# EAGLE design lcdork (EAGLE 5.06)
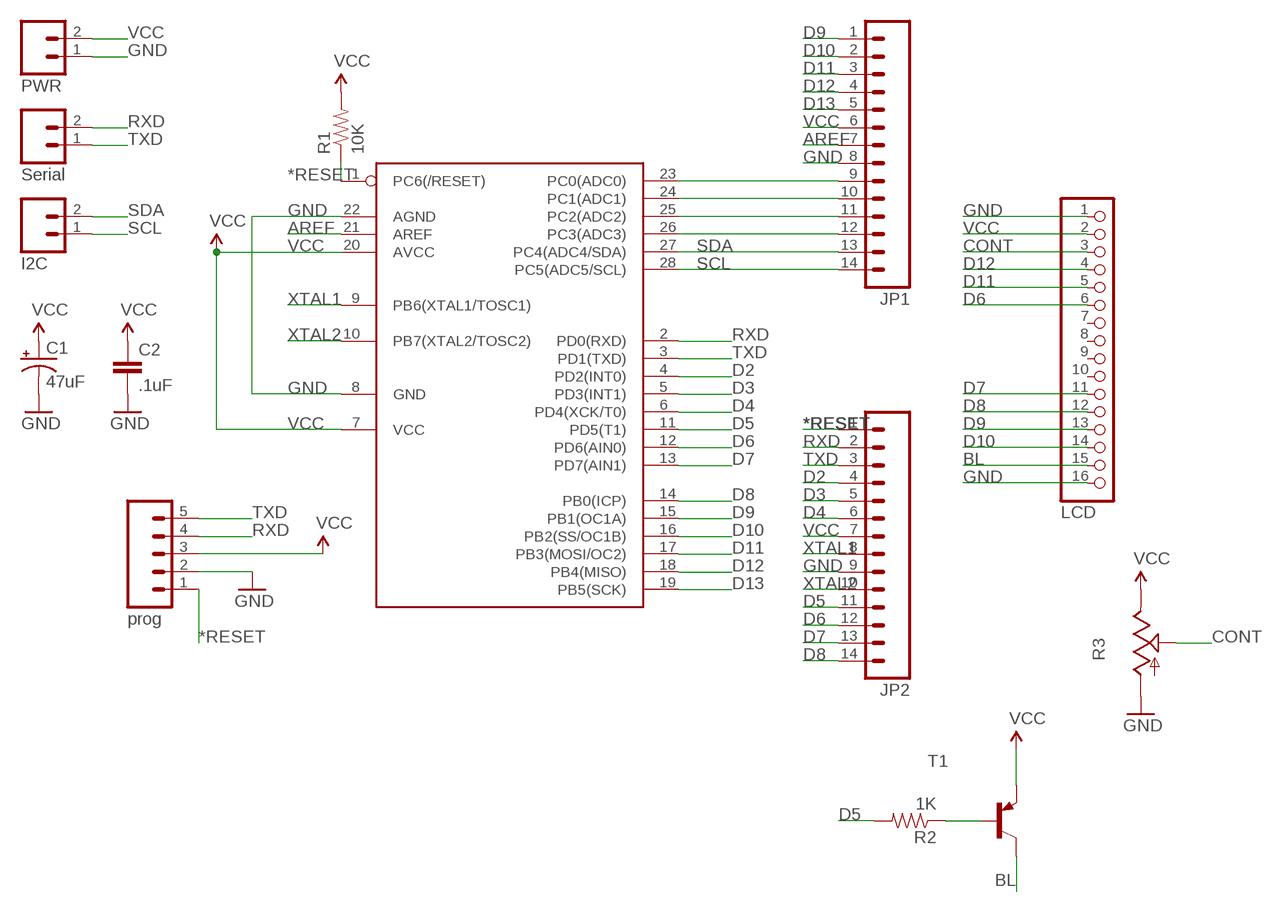
[diagram p0: schematic, sheet 1]

## Parts
C1  47uF  CAP_POLPTH2  [CPOL-RADIAL-10UF-25V]
C2  .1uF  CAP0805  [0805]
I2C  I2C  M02PTH  [1X02]
IC1  MEGA168-P  MEGA8-P  [DIL28-3]
JP1  M14  [1X14]
JP2  M14  [1X14]
JP7  LCD  PINHD-1X16  [1X16]
PROG  prog  M05LOCK  [1X05_LOCK]
PWR  PWR  M02PTH  [1X02]
R1  10K  RESISTOR  [0805]
R2  1K  RESISTOR  [0805]
R3  TRIM_US-B64Y  [B64Y]
SERIAL  Serial  M02PTH  [1X02]
T1  2N3906-PNP-TO92-EBC  [TO92-EBC]

## Nets
*RESET: IC1.1(PC6(/RESET)) JP2.1 PROG.1 R1.1
AREF: IC1.21(AREF) JP1.7
BL: JP7.15 T1.C
CONT: JP7.3 R3.S
D2: IC1.4(PD2(INT0)) JP2.4
D3: IC1.5(PD3(INT1)) JP2.5
D4: IC1.6(PD4(XCK/T0)) JP2.6
D5: IC1.11(PD5(T1)) JP2.11 R2.2
D6: IC1.12(PD6(AIN0)) JP2.12 JP7.6
D7: IC1.13(PD7(AIN1)) JP2.13 JP7.11
D8: IC1.14(PB0(ICP)) JP2.14 JP7.12
D9: IC1.15(PB1(OC1A)) JP1.1 JP7.13
D10: IC1.16(PB2(SS/OC1B)) JP1.2 JP7.14
D11: IC1.17(PB3(MOSI/OC2)) JP1.3 JP7.5
D12: IC1.18(PB4(MISO)) JP1.4 JP7.4
D13: IC1.19(PB5(SCK)) JP1.5
GND: C1.2(-) C2.2 IC1.8(GND) IC1.22(AGND) JP1.8 JP2.9 JP7.1 JP7.16 PROG.2 PWR.1 R3.A
N$1: IC1.23(PC0(ADC0)) JP1.9
N$2: IC1.24(PC1(ADC1)) JP1.10
N$3: IC1.25(PC2(ADC2)) JP1.11
N$4: IC1.26(PC3(ADC3)) JP1.12
N$7: R2.1 T1.B
RXD: IC1.2(PD0(RXD)) JP2.2 PROG.4 SERIAL.2
SCL: I2C.1 IC1.28(PC5(ADC5/SCL)) JP1.14
SDA: I2C.2 IC1.27(PC4(ADC4/SDA)) JP1.13
TXD: IC1.3(PD1(TXD)) JP2.3 PROG.5 SERIAL.1
VCC: C1.1(+) C2.1 IC1.7(VCC) IC1.20(AVCC) JP1.6 JP2.7 JP7.2 PROG.3 PWR.2 R1.2 R3.E T1.E
XTAL1: IC1.9(PB6(XTAL1/TOSC1)) JP2.8
XTAL2: IC1.10(PB7(XTAL2/TOSC2)) JP2.10
Unconnected: JP7.7 JP7.8 JP7.9 JP7.10

## Library data of the parts
C1 = SparkFun:CAP_POL: Capacitor Polarized These are standard SMD and PTH capacitors. Normally 10uF, 47uF, and 100uF in electrolytic and tantalum varieties. Always verify the external diameter of the through hole cap, it varies with capacity, voltage, and manufacturer. The EIA devices should be standard.
C2 = SparkFun:CAP: Capacitor Standard 0603 ceramic capacitor, and 0.1" leaded capacitor.
I2C PWR SERIAL = SparkFun:M02: Header 2 Standard 2-pin 0.1" header. Use with straight break away headers (SKU : PRT-00116), right angle break away headers (PRT-00553), swiss pins (PRT-00743), machine pins (PRT-00117), and female headers (PRT-00115). Molex polarized connector foot print use with SKU : PRT-08233 with associated crimp pins and housings.
IC1 = atmel1:MEGA8-P: MICROCONTROLLER 8 Kbytes FLASH 1 kbytes SRAM 512 bytes EEPROM USART 4-channel 10 bit ADC 2-channel 8 bit ADC
JP1 JP2 = SparkFun:M14: Header 14 Standard 14-pin 0.1" header. Use with straight break away headers (SKU : PRT-00116), right angle break away headers (PRT-00553), swiss pins (PRT-00743), machine pins (PRT-00117), and female headers (PRT-00115).
JP7 = pinhead:PINHD-1X16: PIN HEADER
PROG = SparkFun:M05: Header 5 Standard 5-pin 0.1" header. Use with straight break away headers (SKU : PRT-00116), right angle break away headers (PRT-00553), swiss pins (PRT-00743), machine pins (PRT-00117), and female headers (PRT-00115). Molex polarized connector foot print use with SKU : PRT-08230 with associated crimp pins and housings.
R1 R2 = SparkFun:RESISTOR: Resistor Basic schematic elements and footprints for 0603, 1206, and PTH 1/10th watt (small) resistors.
R3 = pot:TRIM_US-: POTENTIOMETER
T1 = transistor-neu-to92:*-PNP-: PNP Transistror

## Board
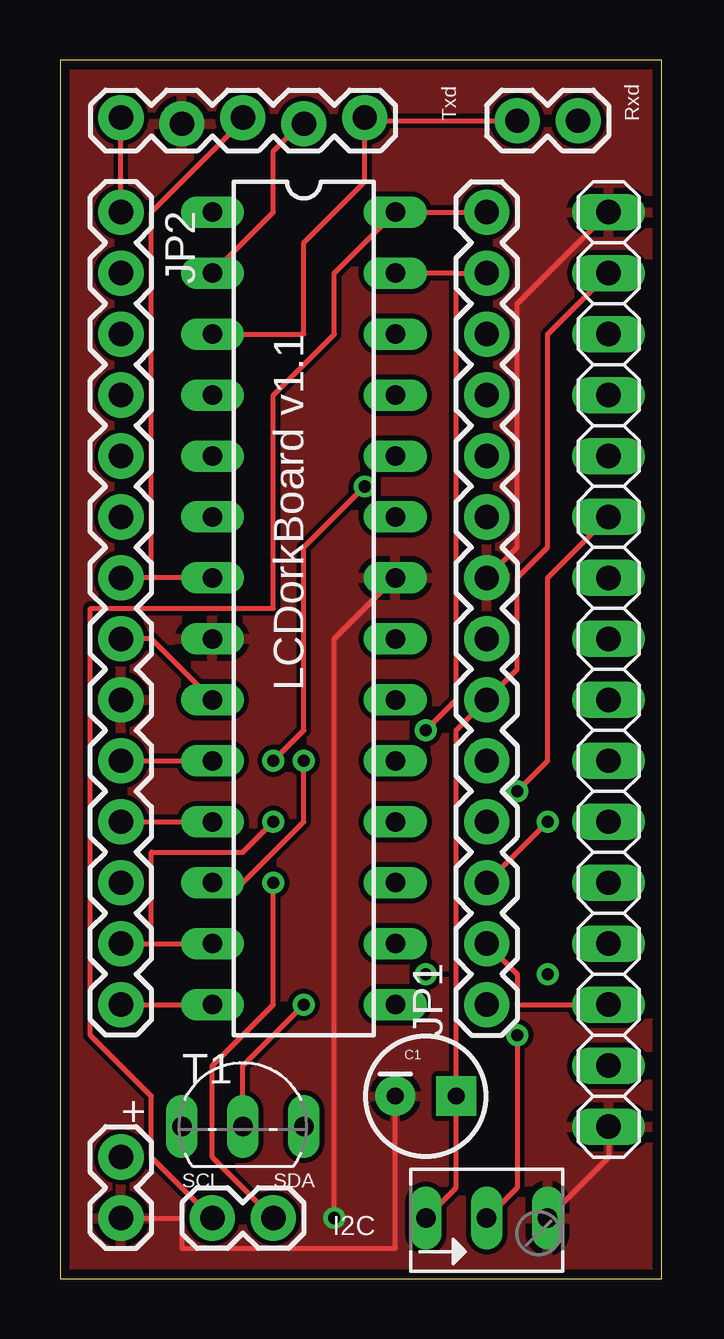
[diagram p1: board, top side]
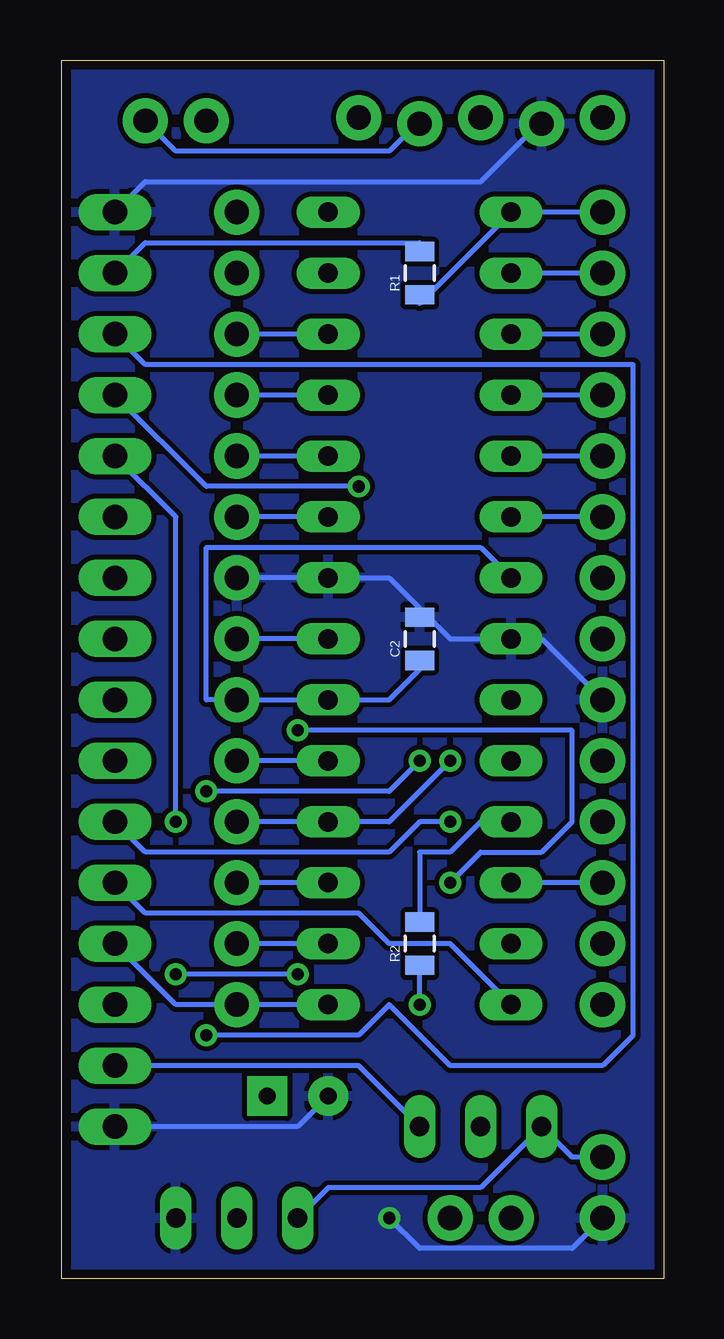
[diagram p2: board, bottom side, seen from below]

Size 25.07 x 50.79 mm. Coordinates in mm from the lower left corner, seen from the top.
Outline: 0,0 25.07,0 25.07,50.79 0,50.79 0,0
Copper layers (1*16): Top 0.035mm / dielectric 1.5mm / Bottom 0.035mm
Design rules "PCBGroupOrder": minimum track width 8mil, minimum drill 20mil, track to track 8mil, track to pad 8mil, pad to pad 8mil, via to via 8mil, smd to smd 8mil, copper to edge 15mil, drill to drill 8mil, minimum pad ring 10mil, minimum via ring 8mil, stop-mask expansion 4mil, vias tented up to drill 0mil, thermal gap 10mil

### Footprints (pad centres in the part's own frame; a part is rotated, then mirrored left to right if it is on the bottom)
CPOL-RADIAL-10UF-25V = drill 0.7 pad 1.651 square: 1 1.27,0 | drill 0.7 pad 1.651 round: 2 -1.27,0
0805 = smd 0.8 x 1.2: 1 -0.9,0; 2 0.9,0
1X02 = drill 1.016 pad 1.88 round: 1 0,0; 2 2.54,0
DIL28-3 = drill 0.813 long: 1 -16.51,-3.81; 2 -13.97,-3.81; 3 -11.43,-3.81; 4 -8.89,-3.81; 5 -6.35,-3.81; 6 -3.81,-3.81; 7 -1.27,-3.81; 8 1.27,-3.81; 9 3.81,-3.81; 10 6.35,-3.81; 11 8.89,-3.81; 12 11.43,-3.81; 13 13.97,-3.81; 14 16.51,-3.81; 15 16.51,3.81; 16 13.97,3.81; 17 11.43,3.81; 18 8.89,3.81; 19 6.35,3.81; 20 3.81,3.81; 21 1.27,3.81; 22 -1.27,3.81; 23 -3.81,3.81; 24 -6.35,3.81; 25 -8.89,3.81; 26 -11.43,3.81; 27 -13.97,3.81; 28 -16.51,3.81
1X14 = drill 1.016 pad 1.88 round: 1 0,0; 2 2.54,0; 3 5.08,0; 4 7.62,0; 5 10.16,0; 6 12.7,0; 7 15.24,0; 8 17.78,0; 9 20.32,0; 10 22.86,0; 11 25.4,0; 12 27.94,0; 13 30.48,0; 14 33.02,0
1X16 = drill 1.016 long: 1 -19.05,0; 2 -16.51,0; 3 -13.97,0; 4 -11.43,0; 5 -8.89,0; 6 -6.35,0; 7 -3.81,0; 8 -1.27,0; 9 1.27,0; 10 3.81,0; 11 6.35,0; 12 8.89,0; 13 11.43,0; 14 13.97,0; 15 16.51,0; 16 19.05,0
1X05_LOCK = drill 1.016 pad 1.88 round: 1 0,0.127; 2 2.54,-0.127; 3 5.08,0.127; 4 7.62,-0.127; 5 10.16,0.127
B64Y = drill 0.813 long: A 2.54,0; E -2.54,0; S 0,0
TO92-EBC = drill 0.813 long: B 0,-1.27; C 2.54,-1.27; E -2.54,-1.27

### Placement (x,y rotation side)
C1  15.24,7.62 0 top
C2  10.16,26.67 90 bottom
I2C  6.35,2.54 0 top
IC1  10.16,27.94 270 top
JP1  17.78,11.43 90 top
JP2  2.54,44.45 270 top
JP7  22.86,25.4 270 top
PROG  2.54,48.26 0 top
PWR  2.54,2.54 90 top
R1  10.16,41.91 90 bottom
R2  10.16,13.97 90 bottom
R3  17.78,2.54 0 top
SERIAL  19.05,48.26 0 top
T1  7.62,7.62 0 top

### Tracks (layer width: path | path; a pad name or v marks a point on that pad's centre or on a via)
*RESET
  Top 0.203: JP2.1 PROG.1
  Bottom 0.203: R1.1 10.16,40.64 IC1.1 JP2.1
AREF
  Bottom 0.203: IC1.21 JP1.7
BL
  Bottom 0.203: T1.C 12.7,8.89 JP7.15
CONT  (via drill 0.51)
  Top 0.203: R3.S 19.05,3.81 v19.05,10.16
  Bottom 0.203: v19.05,10.16 12.7,10.16 11.43,11.43 8.89,8.89 2.54,8.89 1.27,10.16 1.27,38.1 21.59,38.1 JP7.3
D2
  Bottom 0.203: JP2.4 IC1.4
D3
  Bottom 0.203: JP2.5 IC1.5
D4
  Bottom 0.203: JP2.6 IC1.6
D5
  Top 0.203: JP2.11 IC1.11
  Bottom 0.203: IC1.11 7.62,19.05 8.89,17.78 10.16,17.78 R2.2
D6  (via drill 0.51)
  Top 0.203: JP7.6 20.32,29.21 20.32,21.59 v19.05,20.32 | v10.16,21.59 10.16,19.05 7.62,16.51 IC1.12
  Bottom 0.203: JP2.12 IC1.12 | v19.05,20.32 11.43,20.32 v10.16,21.59
D7  (via drill 0.51)
  Top 0.203: JP2.13 3.81,13.97 | 3.81,13.97 IC1.13 | v8.89,19.05 7.62,17.78 3.81,17.78 3.81,13.97
  Bottom 0.203: JP7.11 21.59,17.78 11.43,17.78 10.16,19.05 v8.89,19.05
D8
  Top 0.203: JP2.14 IC1.14
  Bottom 0.203: JP7.12 21.59,15.24 12.7,15.24 11.43,13.97 8.89,13.97 IC1.14
D9
  Bottom 0.203: IC1.15 JP1.1 20.32,11.43 JP7.13
D10
  Top 0.203: JP7.14 19.05,11.43 19.05,12.7 JP1.2
  Bottom 0.203: IC1.16 JP1.2
D11  (via drill 0.51)
  Top 0.203: JP1.3 v20.32,19.05
  Bottom 0.203: IC1.17 JP1.3 | JP7.5 20.32,31.75 v20.32,19.05
D12  (via drill 0.51)
  Top 0.203: v12.7,33.02 10.16,30.48 10.16,22.86 v8.89,21.59
  Bottom 0.203: JP1.4 IC1.18 11.43,19.05 v8.89,21.59 | JP7.4 19.05,33.02 v12.7,33.02
D13
  Bottom 0.203: IC1.19 JP1.5
GND  (via drill 0.51)
  Top 0.203: R3.A 22.86,5.08 JP7.16 | PWR.1 5.08,2.54 5.08,1.27 13.97,1.27 C1.2 | JP7.1 19.05,40.64 19.05,30.48 JP1.8 | v11.43,2.54 11.43,26.67 IC1.22
  Bottom 0.203: C1.2 15.24,6.35 JP7.16 | 10.16,27.94 8.89,26.67 IC1.8 5.08,26.67 JP2.9 | JP1.8 IC1.22 11.43,29.21 10.16,27.94 | 10.16,27.94 C2.2 | JP7.1 21.59,45.72 7.62,45.72 5.08,48.26 PROG.2 | PWR.1 3.81,1.27 10.16,1.27 v11.43,2.54
  pour Bottom: 0,50.8 25.4,50.8 25.4,0 0,0
  pour Top: 0,50.8 25.4,50.8 25.4,0 0,0
N$1
  Bottom 0.203: IC1.23 JP1.9
N$2
  Bottom 0.203: IC1.24 JP1.10
N$3
  Bottom 0.203: IC1.25 JP1.11
N$4
  Bottom 0.203: IC1.26 JP1.12
N$5  (via drill 0.51)
  Bottom 0.203: v15.24,12.7 v20.32,12.7
N$6
  pour Bottom: 0,50.8 25.4,50.8 25.4,0 0,0
N$7  (via drill 0.51)
  Top 0.203: v10.16,11.43 7.62,8.89 T1.B
  Bottom 0.203: v10.16,11.43 R2.1
RXD
  Top 0.203: IC1.2 8.89,44.45 8.89,46.99 10.16,48.26 PROG.4
  Bottom 0.203: JP2.2 IC1.2 | SERIAL.2 20.32,46.99 11.43,46.99 10.16,48.26 PROG.4
SCL
  Top 0.203: JP1.14 IC1.28 11.43,41.91 11.43,39.37 8.89,36.83 8.89,27.94 1.27,27.94 1.27,10.16 3.81,7.62 3.81,5.08 I2C.1
SDA  (via drill 0.51)
  Top 0.203: 16.51,41.91 JP1.13 | 16.51,41.91 IC1.27 | I2C.2 6.35,5.08 6.35,8.89 8.89,11.43 v8.89,16.51 | v15.24,22.86 16.51,24.13 16.51,41.91
  Bottom 0.203: v8.89,16.51 7.62,17.78 5.08,17.78 3.81,19.05 3.81,22.86 v15.24,22.86
TXD
  Top 0.203: 12.7,48.26 SERIAL.1 | IC1.3 10.16,39.37 10.16,43.18 12.7,45.72 12.7,48.26 | 12.7,48.26 PROG.5
  Bottom 0.203: JP2.3 IC1.3
VCC
  Top 0.203: 3.81,29.21 JP2.7 | IC1.7 3.81,29.21 | 3.81,29.21 3.81,44.45 7.62,48.26 PROG.3 | R3.E 16.51,3.81 C1.1 16.51,22.86 JP1.6 19.05,25.4 19.05,29.21 20.32,30.48 20.32,39.37 JP7.2
  Bottom 0.203: JP7.2 21.59,43.18 10.16,43.18 R1.2 | C2.1 10.16,25.4 11.43,24.13 IC1.20 JP1.6 19.05,24.13 19.05,30.48 7.62,30.48 IC1.7 | PWR.2 3.81,5.08 T1.E 7.62,3.81 13.97,3.81 R3.E
XTAL1
  Top 0.203: IC1.9 3.81,26.67 JP2.8
XTAL2
  Top 0.203: JP2.10 IC1.10

### Text on the board
tNames: Txd | Rxd | LCDorkBoard v1.1 | + | SCL | SDA